# Altium schematic sheet Control Decoder Electronic Squeme_2021-10-07.schdoc
size 300 x 191 mm
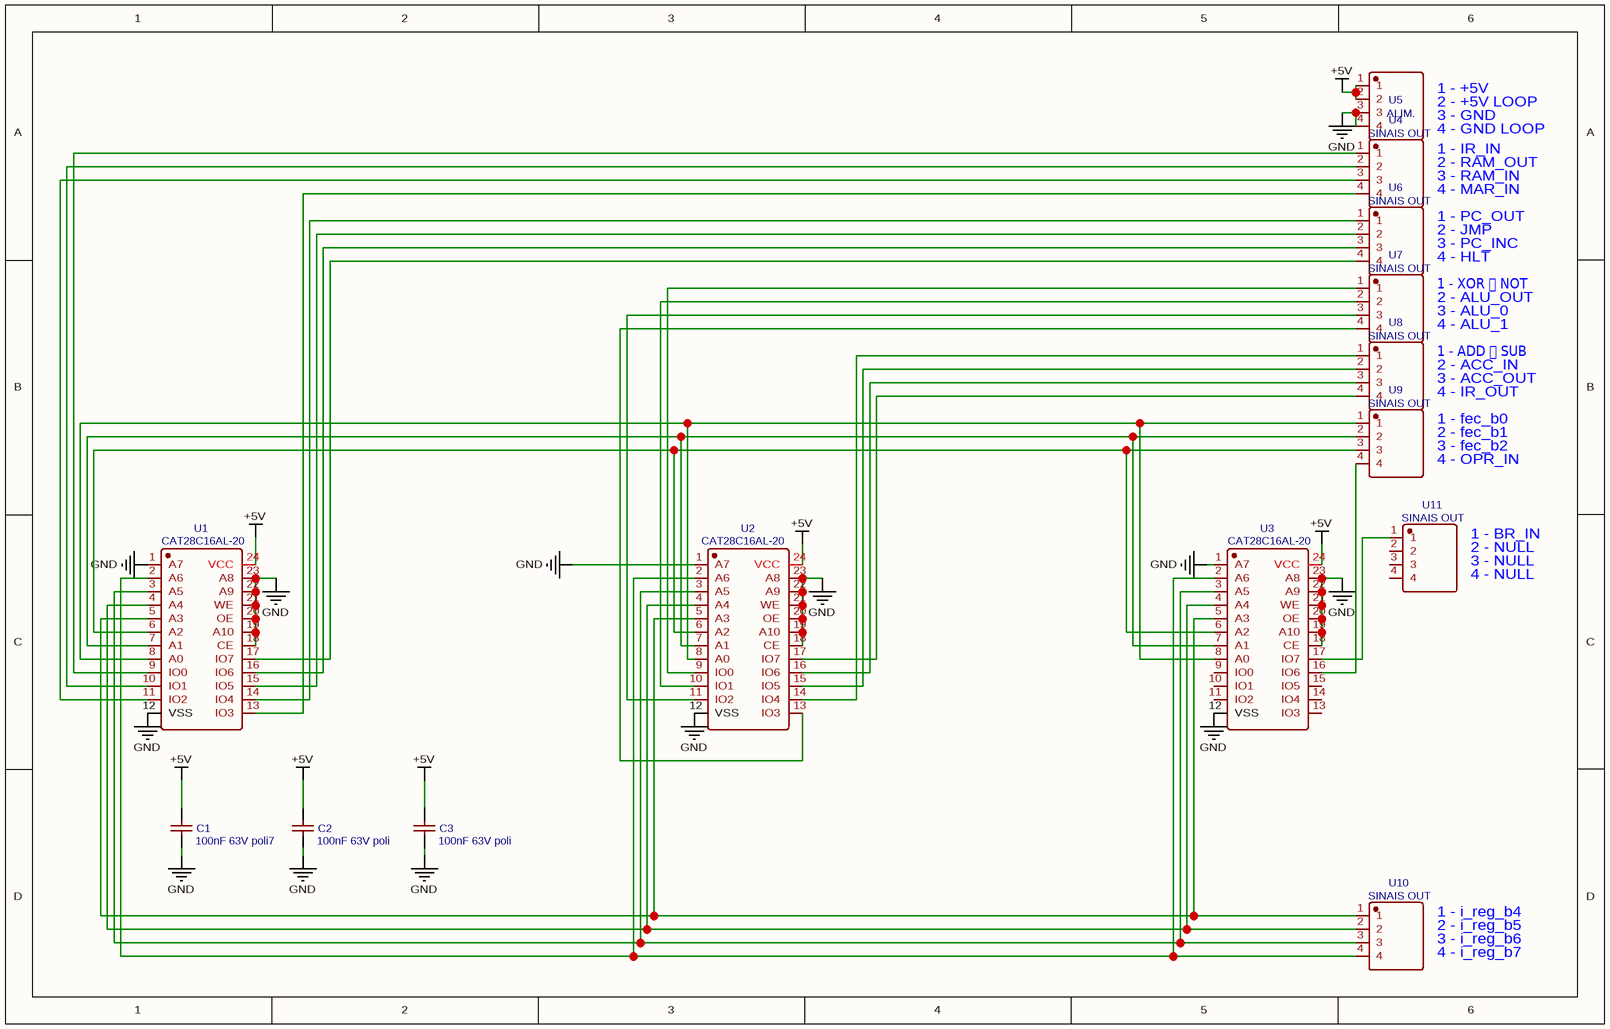
[diagram p0: Control Decoder Electronic Squeme_2021-10-07.schdoc]

## Parts
C1  100nF 63V poli7  [CAP-TH_L7.6-W3.8-P5.08-D0.51]
C2  100nF 63V poli  [CAP-TH_L7.6-W3.8-P5.08-D0.51]
C3  100nF 63V poli  [CAP-TH_L7.6-W3.8-P5.08-D0.51]
U1  CAT28C16AL-20  [DIP24-600]
U2  CAT28C16AL-20  [DIP24-600]
U3  CAT28C16AL-20  [DIP24-600]
U4  SINAIS OUT  [HDR-TH_4P-P2.54-D1.0]
U5  ALIM.  [HDR-TH_4P-P2.54-D1.0]
U6  SINAIS OUT  [HDR-TH_4P-P2.54-D1.0]
U7  SINAIS OUT  [HDR-TH_4P-P2.54-D1.0]
U8  SINAIS OUT  [HDR-TH_4P-P2.54-D1.0]
U9  SINAIS OUT  [HDR-TH_4P-P2.54-D1.0]
U10  SINAIS OUT  [HDR-TH_4P-P2.54-D1.0]
U11  SINAIS OUT  [HDR-TH_4P-P2.54-D1.0]

## Nets
+5V: C1.1 C2.1 C3.1 U1.24(VCC) U2.24(VCC) U3.24(VCC) U5.1 U5.2
GND: C1.2 C2.2 C3.2 U1.1(A7) U1.12(VSS) U1.18(CE) U1.19(A10) U1.20(OE) U1.21(WE) U1.22(A9) U1.23(A8) U2.1(A7) U2.12(VSS) U2.18(CE) U2.19(A10) U2.20(OE) U2.21(WE) U2.22(A9) U2.23(A8) U3.1(A7) U3.12(VSS) U3.18(CE) U3.19(A10) U3.20(OE) U3.21(WE) U3.22(A9) U3.23(A8) U5.3 U5.4
NetU1_2: U1.2(A6) U2.2(A6) U3.2(A6) U10.4
NetU1_3: U1.3(A5) U2.3(A5) U3.3(A5) U10.3
NetU1_4: U1.4(A4) U2.4(A4) U3.4(A4) U10.2
NetU1_5: U1.5(A3) U2.5(A3) U3.5(A3) U10.1
NetU1_6: U1.6(A2) U2.6(A2) U3.6(A2) U9.3
NetU1_7: U1.7(A1) U2.7(A1) U3.7(A1) U9.2
NetU1_8: U1.8(A0) U2.8(A0) U3.8(A0) U9.1
NetU1_9: U1.9(IO0) U4.1
NetU1_10: U1.10(IO1) U4.2
NetU1_11: U1.11(IO2) U4.3
NetU1_13: U1.13(IO3) U4.4
NetU1_14: U1.14(IO4) U6.1
NetU1_15: U1.15(IO5) U6.2
NetU1_16: U1.16(IO6) U6.3
NetU1_17: U1.17(IO7) U6.4
NetU2_9: U2.9(IO0) U7.1
NetU2_10: U2.10(IO1) U7.2
NetU2_11: U2.11(IO2) U7.3
NetU2_13: U2.13(IO3) U7.4
NetU2_14: U2.14(IO4) U8.1
NetU2_15: U2.15(IO5) U8.2
NetU2_16: U2.16(IO6) U8.3
NetU2_17: U2.17(IO7) U8.4
NetU3_16: U3.16(IO6) U3.17(IO7) U9.4 U11.1

Not connected (* = marked no-connect by the designer): U3 9(IO0) 10(IO1) 11(IO2) 13(IO3) 14(IO4) 15(IO5); U11 2 3 4

## Notes on the sheet
- 2 - +5V LOOP
- 1 - +5V
- 2 - RAM_OUT
- 1 - IR_IN
- 4 - GND LOOP
- 3 - GND
- 3 - RAM_IN
- 4 - MAR_IN
- 1 - PC_OUT
- 2 - JMP
- 4 - HLT
- 3 - PC_INC
- 1 - XOR  NOT
- 2 - ALU_OUT
- 4 - ALU_1
- 3 - ALU_0
- 1 - ADD  SUB
- 2 - ACC_IN
- 4 - IR_OUT
- 3 - ACC_OUT
- 1 - fec_b0
- 2 - fec_b1
- 4 - OPR_IN
- 3 - fec_b2
- 2 - NULL
- 3 - NULL
- 4 - NULL
- 1 - BR_IN
- 1 - i_reg_b4
- 2 - i_reg_b5
- 3 - i_reg_b6
- 4 - i_reg_b7

## Library data of the parts
C1 = 100nF 63V poli7: BOM_Manufacturer: AVX; BOM_Manufacturer Part: SR305C105KAR; nameAlias: Capacitance; Contributor: LCSC; BOM_Supplier: LCSC; BOM_Supplier Part: C444741; BOM_JLCPCB Part Class: Extended Part; spicePre: C; spiceSymbolName: SR305C105KAR
C2 C3 = 100nF 63V poli: BOM_Manufacturer: AVX; BOM_Manufacturer Part: SR305C105KAR; nameAlias: Capacitance; Contributor: LCSC; BOM_Supplier: LCSC; BOM_Supplier Part: C444741; BOM_JLCPCB Part Class: Extended Part; spicePre: C; spiceSymbolName: SR305C105KAR
U4 U6-U11 = SINAIS OUT: BOM_Manufacturer: TE Connectivity; BOM_Manufacturer Part: 171825-4; Contributor: LCSC; BOM_Supplier: LCSC; BOM_Supplier Part: C210162; BOM_JLCPCB Part Class: Extended Part; spicePre: U; spiceSymbolName: 171825-4
U5 = ALIM.: BOM_Manufacturer: TE Connectivity; BOM_Manufacturer Part: 171825-4; Contributor: LCSC; BOM_Supplier: LCSC; BOM_Supplier Part: C210162; BOM_JLCPCB Part Class: Extended Part; spicePre: U; spiceSymbolName: 171825-4
U1-U3 = CAT28C16AL-20: spicePre: X; spiceSymbolName: CAT28C16AL-20